# EAGLE schematic zx_kit3 (EAGLE 6.5.0)

## Sheet 1 of 2
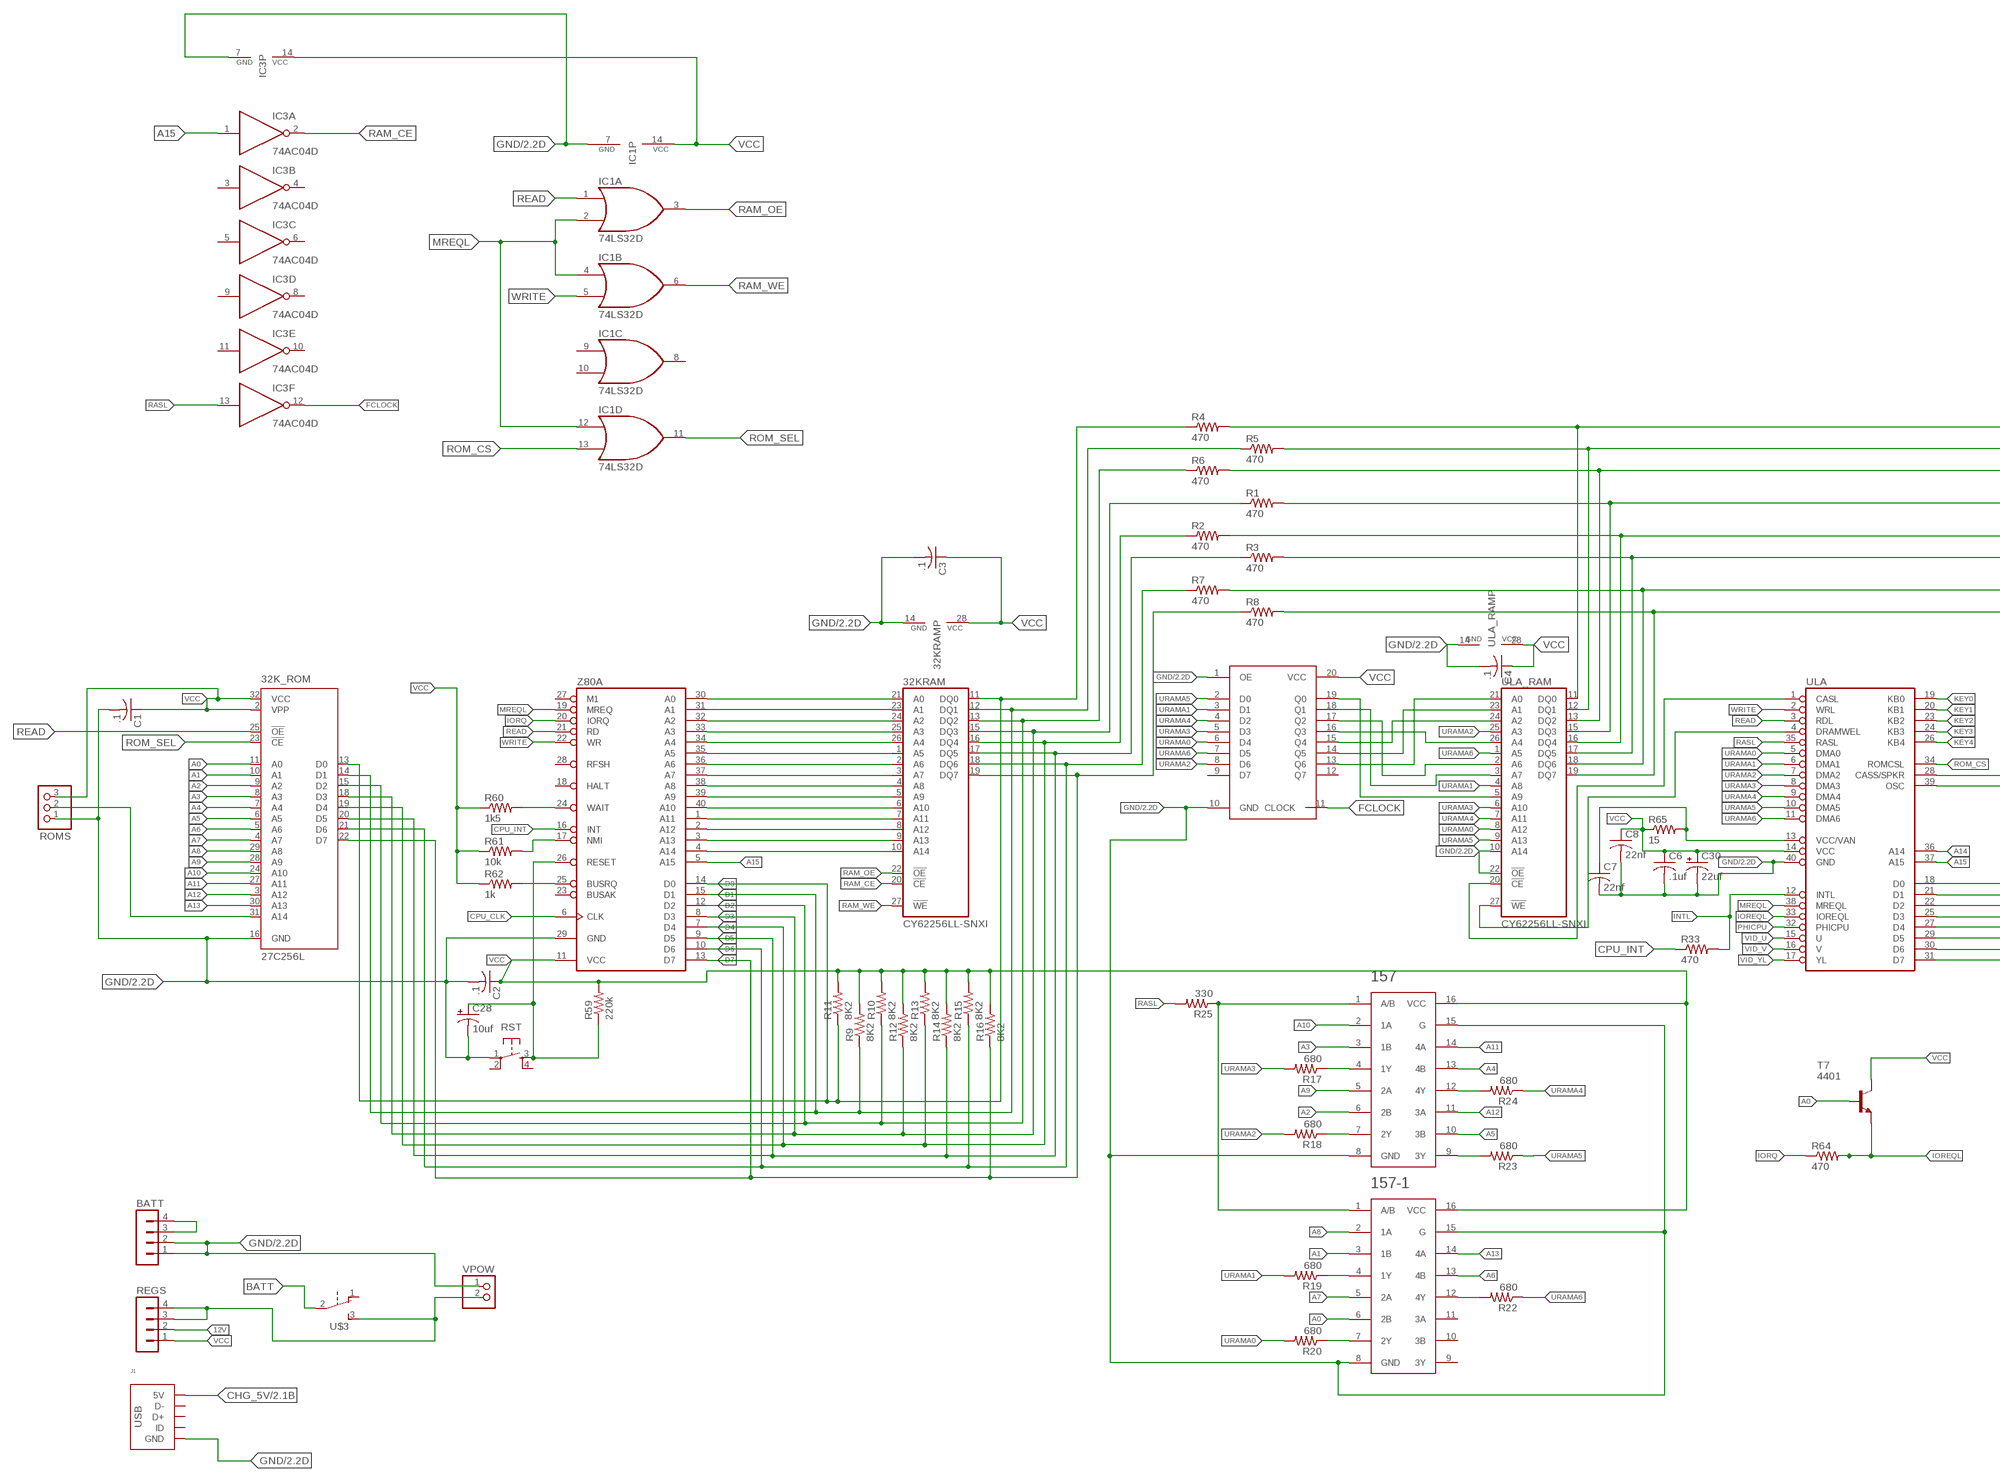
[diagram p0: schematic, sheet 1, part 1 of 3]
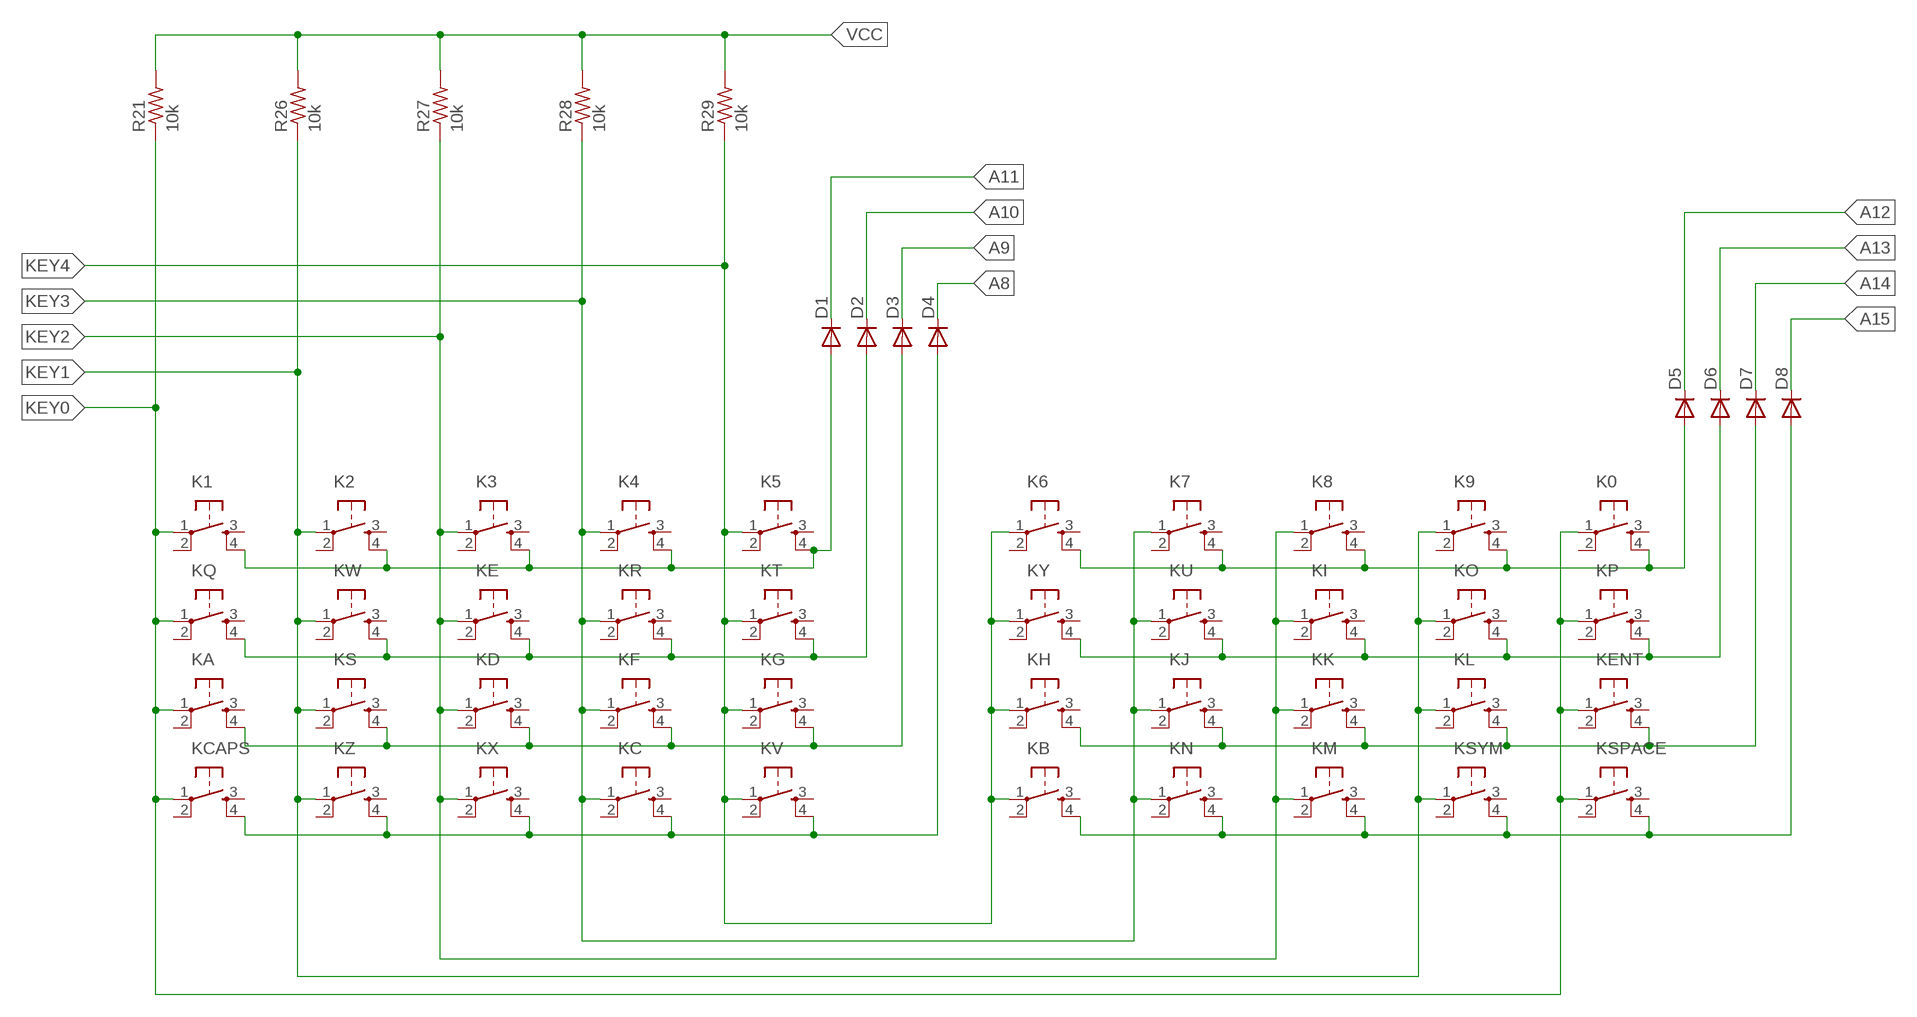
[diagram p1: schematic, sheet 1, part 2 of 3]
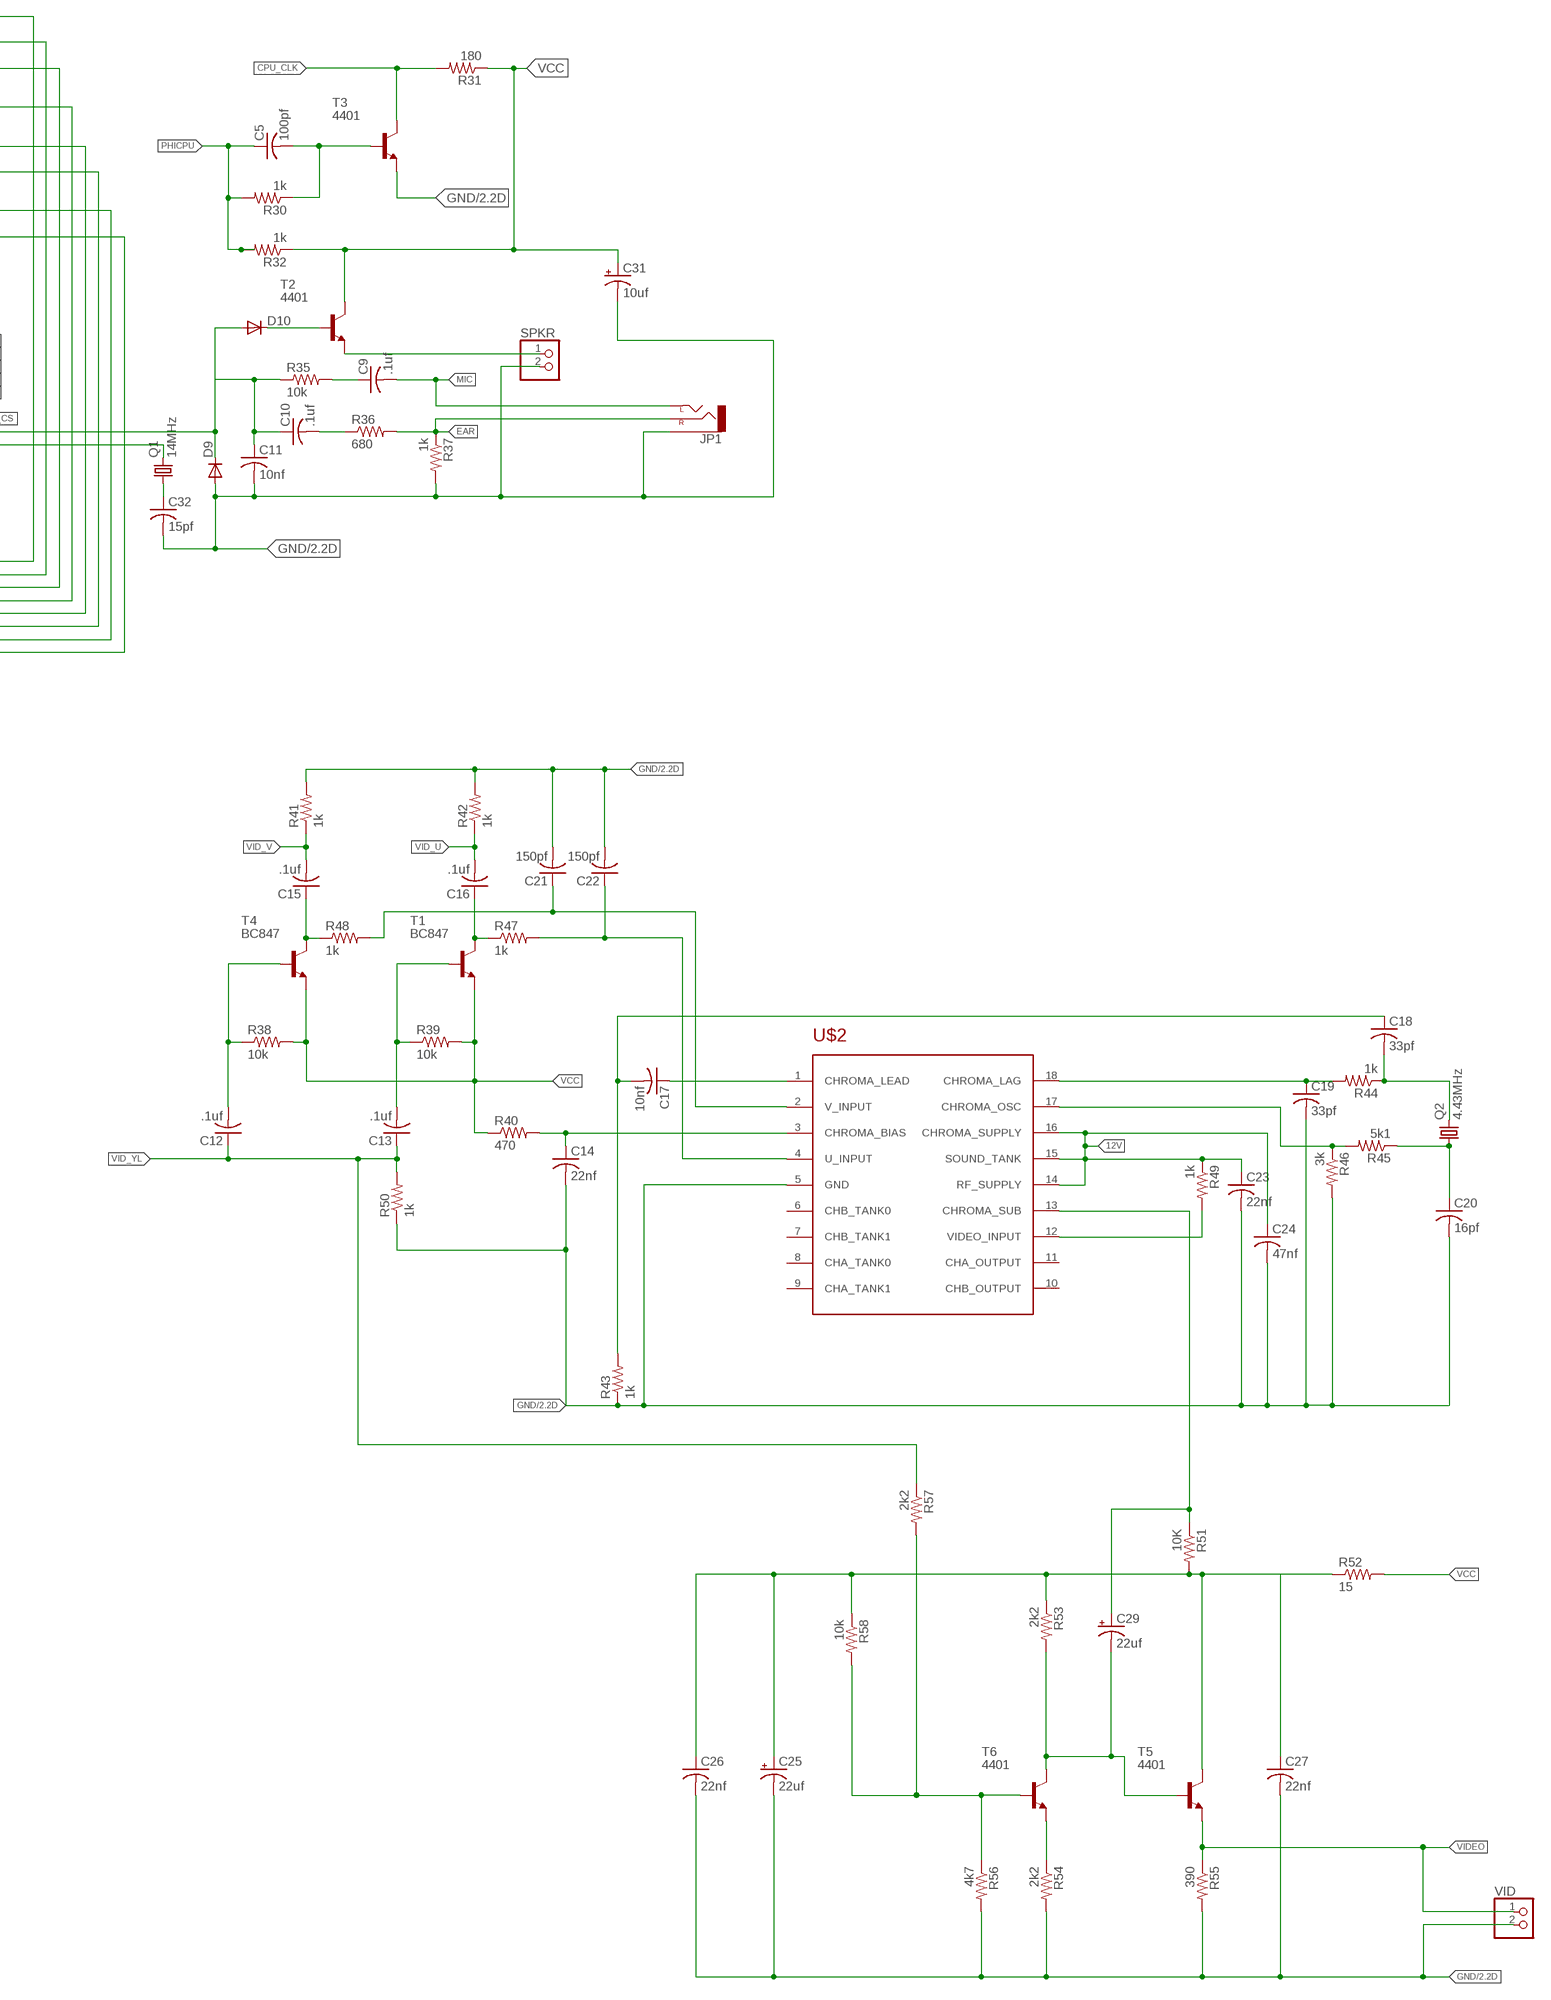
[diagram p2: schematic, sheet 1, part 3 of 3]

### Parts
32K_ROM  27C256L  [PLCC-32]
32KRAM  CY62256LL-SNXI  [SOJ28/3]
157  SN74HC157D  [SO16]
157-1  SN74HC157D  [SO16]
BATT  MA04-1  [MA04-1]
C1  .1  C-USC0805  [C0805]
C2  .1  C-USC0805  [C0805]
C3  .1  C-USC0805  [C0805]
C4  .1  C-USC0805  [C0805]
C5  100pf  C-USC0805  [C0805]
C6  .1uf  C-USC0805  [C0805]
C7  22nf  C-USC0805  [C0805]
C8  22nf  C-USC0805  [C0805]
C9  .1uf  C-USC0805  [C0805]
C10  .1uf  C-USC0805  [C0805]
C11  10nf  C-USC0805  [C0805]
C12  .1uf  C-USC0805  [C0805]
C13  .1uf  C-USC0805  [C0805]
C14  22nf  C-USC0805  [C0805]
C15  .1uf  C-USC0805  [C0805]
C16  .1uf  C-USC0805  [C0805]
C17  10nf  C-USC0805  [C0805]
C18  33pf  C-USC0805  [C0805]
C19  33pf  C-USC0805  [C0805]
C20  16pf  C-USC0805  [C0805]
C21  150pf  C-USC0805  [C0805]
C22  150pf  C-USC0805  [C0805]
C23  22nf  C-USC0805  [C0805]
C24  47nf  C-USC0805  [C0805]
C25  22uf  CPOL-USB  [PANASONIC_B]
C26  22nf  C-USC0805  [C0805]
C27  22nf  C-USC0805  [C0805]
C28  10uf  CPOL-USB  [PANASONIC_B]
C29  22uf  CPOL-USB  [PANASONIC_B]
C30  22uf  CPOL-USB  [PANASONIC_B]
C31  10uf  CPOL-USB  [PANASONIC_B]
C32  15pf  C-USC0805  [C0805]
D1  DIODE-SOD123  [SOD123]
D2  DIODE-SOD123  [SOD123]
D3  DIODE-SOD123  [SOD123]
D4  DIODE-SOD123  [SOD123]
D5  DIODE-SOD123  [SOD123]
D6  DIODE-SOD123  [SOD123]
D7  DIODE-SOD123  [SOD123]
D8  DIODE-SOD123  [SOD123]
D9  DIODE-SOD123  [SOD123]
D10  DIODE-SOD123  [SOD123]
IC1  74LS32D  [SO14]
IC3  74AC04D  [SO14]
J1  USBMC32599  [MC32599]
JP1  AUDIO-JACKPTH  [AUDIO-JACK]
K0  DTS-6  [DTS-6]
K1  DTS-6  [DTS-6]
K2  DTS-6  [DTS-6]
K3  DTS-6  [DTS-6]
K4  DTS-6  [DTS-6]
K5  DTS-6  [DTS-6]
K6  DTS-6  [DTS-6]
K7  DTS-6  [DTS-6]
K8  DTS-6  [DTS-6]
K9  DTS-6  [DTS-6]
KA  DTS-6  [DTS-6]
KB  DTS-6  [DTS-6]
KC  DTS-6  [DTS-6]
KCAPS  DTS-6  [DTS-6]
KD  DTS-6  [DTS-6]
KE  DTS-6  [DTS-6]
KENT  DTS-6  [DTS-6]
KF  DTS-6  [DTS-6]
KG  DTS-6  [DTS-6]
KH  DTS-6  [DTS-6]
KI  DTS-6  [DTS-6]
KJ  DTS-6  [DTS-6]
KK  DTS-6  [DTS-6]
KL  DTS-6  [DTS-6]
KM  DTS-6  [DTS-6]
KN  DTS-6  [DTS-6]
KO  DTS-6  [DTS-6]
KP  DTS-6  [DTS-6]
KQ  DTS-6  [DTS-6]
KR  DTS-6  [DTS-6]
KS  DTS-6  [DTS-6]
KSPACE  DTS-6  [DTS-6]
KSYM  DTS-6  [DTS-6]
KT  DTS-6  [DTS-6]
KU  DTS-6  [DTS-6]
KV  DTS-6  [DTS-6]
KW  DTS-6  [DTS-6]
KX  DTS-6  [DTS-6]
KY  DTS-6  [DTS-6]
KZ  DTS-6  [DTS-6]
Q1  14MHz  CRYSTALCTS406  [CTS406]
Q2  4.43MHz  CRYSTALHC49S  [HC49/S]
R1  470  R-US_M0805  [M0805]
R2  470  R-US_M0805  [M0805]
R3  470  R-US_M0805  [M0805]
R4  470  R-US_M0805  [M0805]
R5  470  R-US_M0805  [M0805]
R6  470  R-US_M0805  [M0805]
R7  470  R-US_M0805  [M0805]
R8  470  R-US_M0805  [M0805]
R9  8K2  R-US_M0805  [M0805]
R10  8K2  R-US_M0805  [M0805]
R11  8K2  R-US_M0805  [M0805]
R12  8K2  R-US_M0805  [M0805]
R13  8K2  R-US_M0805  [M0805]
R14  8K2  R-US_M0805  [M0805]
R15  8K2  R-US_M0805  [M0805]
R16  8K2  R-US_M0805  [M0805]
R17  680  R-US_M0805  [M0805]
R18  680  R-US_M0805  [M0805]
R19  680  R-US_M0805  [M0805]
R20  680  R-US_M0805  [M0805]
R21  10k  R-US_R0805  [R0805]
R22  680  R-US_M0805  [M0805]
R23  680  R-US_M0805  [M0805]
R24  680  R-US_M0805  [M0805]
R25  330  R-US_M0805  [M0805]
R26  10k  R-US_R0805  [R0805]
R27  10k  R-US_R0805  [R0805]
R28  10k  R-US_R0805  [R0805]
R29  10k  R-US_R0805  [R0805]
R30  1k  R-US_R0805  [R0805]
R31  180  R-US_R0805  [R0805]
R32  1k  R-US_R0805  [R0805]
R33  470  R-US_R0805  [R0805]
R35  10k  R-US_R0805  [R0805]
R36  680  R-US_R0805  [R0805]
R37  1k  R-US_R0805  [R0805]
R38  10k  R-US_R0805  [R0805]
R39  10k  R-US_R0805  [R0805]
R40  470  R-US_R0805  [R0805]
R41  1k  R-US_R0805  [R0805]
R42  1k  R-US_R0805  [R0805]
R43  1k  R-US_R0805  [R0805]
R44  1k  R-US_R0805  [R0805]
R45  5k1  R-US_R0805  [R0805]
R46  3k  R-US_R0805  [R0805]
R47  1k  R-US_R0805  [R0805]
R48  1k  R-US_R0805  [R0805]
R49  1k  R-US_R0805  [R0805]
R50  1k  R-US_R0805  [R0805]
R51  10K  R-US_R0805  [R0805]
R52  15  R-US_R0805  [R0805]
R53  2k2  R-US_R0805  [R0805]
R54  2k2  R-US_R0805  [R0805]
R55  390  R-US_R0805  [R0805]
R56  4k7  R-US_R0805  [R0805]
R57  2k2  R-US_R0805  [R0805]
R58  10k  R-US_R0805  [R0805]
R59  220k  R-US_M0805  [M0805]
R60  1k5  R-US_M0805  [M0805]
R61  10k  R-US_M0805  [M0805]
R62  1k  R-US_M0805  [M0805]
R64  470  R-US_R0805  [R0805]
R65  15  R-US_R1210  [R1210]
REGS  MA04-1  [MA04-1]
ROMS  PINHD-1X3  [1X03]
RST  DTS-6  [DTS-6]
SPKR  PINHD-1X2  [1X02]
T1  BC847  [SOT23]
T2  4401  MMBT4401LT1-NPN-SOT23-BEC  [SOT23-BEC]
T3  4401  MMBT4401LT1-NPN-SOT23-BEC  [SOT23-BEC]
T4  BC847  [SOT23]
T5  4401  MMBT4401LT1-NPN-SOT23-BEC  [SOT23-BEC]
T6  4401  MMBT4401LT1-NPN-SOT23-BEC  [SOT23-BEC]
T7  4401  MMBT4401LT1-NPN-SOT23-BEC  [SOT23-BEC]
U$1  MC74HC574A  [SO20W]
U$2  LM1889  [SOCKET-18]
U$3  MS12ASW30_01  [MS12ASG30_01]
ULA  ZXULA  [DIL40]
ULA_RAM  CY62256LL-SNXI  [SOJ28/3]
VID  PINHD-1X2  [1X02]
VPOW  PINHD-1X2  [1X02]
Z80A  Z80CPU  [DIL40]

### Nets
12V: C23.1 C24.1 R49.1 REGS.2 U$2.14(RF_SUPPLY) U$2.15(SOUND_TANK) U$2.16(CHROMA_SUPPLY)
A0: 32K_ROM.11(A0) 32KRAM.21(A0) 157-1.6(2B) T7.B Z80A.30(A0)
A1: 32K_ROM.10(A1) 32KRAM.23(A1) 157-1.3(1B) Z80A.31(A1)
A2: 32K_ROM.9(A2) 32KRAM.24(A2) 157.6(2B) Z80A.32(A2)
A3: 32K_ROM.8(A3) 32KRAM.25(A3) 157.3(1B) Z80A.33(A3)
A4: 32K_ROM.7(A4) 32KRAM.26(A4) 157.13(4B) Z80A.34(A4)
A5: 32K_ROM.6(A5) 32KRAM.1(A5) 157.10(3B) Z80A.35(A5)
A6: 32K_ROM.5(A6) 32KRAM.2(A6) 157-1.13(4B) Z80A.36(A6)
A7: 32K_ROM.4(A7) 32KRAM.3(A7) 157-1.5(2A) Z80A.37(A7)
A8: 32K_ROM.29(A8) 32KRAM.4(A8) 157-1.2(1A) D4.C Z80A.38(A8)
A9: 32K_ROM.28(A9) 32KRAM.5(A9) 157.5(2A) D3.C Z80A.39(A9)
A10: 32K_ROM.24(A10) 32KRAM.6(A10) 157.2(1A) D2.C Z80A.40(A10)
A11: 32K_ROM.27(A11) 32KRAM.7(A11) 157.14(4A) D1.C Z80A.1(A11)
A12: 32K_ROM.3(A12) 32KRAM.8(A12) 157.11(3A) D5.C Z80A.2(A12)
A13: 32K_ROM.30(A13) 32KRAM.9(A13) 157-1.14(4A) D6.C Z80A.3(A13)
A14: 32KRAM.10(A14) D7.C ULA.36(A14) Z80A.4(A14)
A15: D8.C IC3.1(A:I) ULA.37(A15) Z80A.5(A15)
BATT: U$3.2(P) ; also sheet 2
CASL: ULA.1(CASL) ULA_RAM.20(!CE)
CASS: C10.1 C11.1 D9.C D10.A R35.1 ULA.28(CASS/SPKR)
CHG_5V: J1.V_BUS(5V) ; also sheet 2
CPU_CLK: R31.2 T3.C Z80A.6(CLK)
CPU_INT: R33.1 Z80A.16(INT)
CPU_RESET: C28.+ R59.1 RST.3 Z80A.26(RESET)
D0: 32K_ROM.13(D0) 32KRAM.11(DQ0) R4.1 R11.1 Z80A.14(D0)
D1: 32K_ROM.14(D1) 32KRAM.12(DQ1) R5.1 R9.1 Z80A.15(D1)
D2: 32K_ROM.15(D2) 32KRAM.13(DQ2) R6.1 R10.1 Z80A.12(D2)
D3: 32K_ROM.18(D3) 32KRAM.15(DQ3) R1.1 R12.1 Z80A.8(D3)
D4: 32K_ROM.19(D4) 32KRAM.16(DQ4) R2.1 R13.1 Z80A.7(D4)
D5: 32K_ROM.20(D5) 32KRAM.17(DQ5) R3.1 R14.1 Z80A.9(D5)
D6: 32K_ROM.21(D6) 32KRAM.18(DQ6) R7.1 R15.1 Z80A.10(D6)
D7: 32K_ROM.22(D7) 32KRAM.19(DQ7) R8.1 R16.1 Z80A.13(D7)
DRAWMWEL: ULA.4(DRAMWEL) ULA_RAM.27(!WE)
EAR: JP1.RING(RIGHT) R36.2 R37.1
FCLOCK: IC3.12(F:O) U$1.11(CLOCK)
FLIPCLOCK: U$1.19(Q0) ULA_RAM.5(A9)
GND: 32K_ROM.16(GND) 32KRAM.14(GND) 157-1.8(GND) 157-1.15(G) 157.8(GND) 157.15(G) BATT.1 BATT.2 C1.2 C2.2 C3.2 C4.2 C6.2 C7.2 C8.2 C11.2 C14.2 C19.2 C20.2 C21.2 C22.2 C23.2 C24.2 C25.- C26.2 C27.2 C28.- C30.- C31.- C32.2 D9.A IC1.7(P:GND) IC3.7(P:GND) J1.GND J1.SH_0(GND) J1.SH_1(GND) J1.SH_2(GND) J1.SH_3(GND) JP1.SLEEVE R37.2 R41.2 R42.2 R43.1 R46.2 R50.1 R54.2 R55.2 R56.2 ROMS.1 RST.1 SPKR.2 T3.E U$1.1(OE) U$1.10(GND) U$2.5(GND) ULA.40(GND) ULA_RAM.10(A14) ULA_RAM.14(GND) ULA_RAM.22(!OE) VID.2 VPOW.1 Z80A.29(GND) ; also sheet 2
INTL: R33.2 ULA.12(INTL)
IOREQL: R64.2 T7.E ULA.33(IOREQL)
IORQ: R64.1 Z80A.20(IORQ)
KEY0: K0.1 K1.1 KA.1 KCAPS.1 KENT.1 KP.1 KQ.1 KSPACE.1 R21.1 ULA.19(KB0)
KEY1: K2.1 K9.1 KL.1 KO.1 KS.1 KSYM.1 KW.1 KZ.1 R26.1 ULA.20(KB1)
KEY2: K3.1 K8.1 KD.1 KE.1 KI.1 KK.1 KM.1 KX.1 R27.1 ULA.23(KB2)
KEY3: K4.1 K7.1 KC.1 KF.1 KJ.1 KN.1 KR.1 KU.1 R28.1 ULA.24(KB3)
KEY4: K5.1 K6.1 KB.1 KG.1 KH.1 KT.1 KV.1 KY.1 R29.1 ULA.26(KB4)
MIC: C9.2 JP1.TIP(LEFT)
MREQL: IC1.2(A:I1) IC1.4(B:I0) IC1.12(D:I0) ULA.38(MREQL) Z80A.19(MREQ)
N$2: R4.2 ULA.18(D0) ULA_RAM.11(DQ0)
N$3: R5.2 ULA.21(D1) ULA_RAM.12(DQ1)
N$4: R6.2 ULA.22(D2) ULA_RAM.13(DQ2)
N$5: R1.2 ULA.25(D3) ULA_RAM.15(DQ3)
N$6: R2.2 ULA.27(D4) ULA_RAM.16(DQ4)
N$7: R3.2 ULA.29(D5) ULA_RAM.17(DQ5)
N$8: R7.2 ULA.30(D6) ULA_RAM.18(DQ6)
N$9: R8.2 ULA.31(D7) ULA_RAM.19(DQ7)
N$10: U$1.13(Q6) ULA_RAM.21(A0)
N$11: U$1.14(Q5) ULA_RAM.23(A1)
N$12: U$1.15(Q4) ULA_RAM.24(A2)
N$13: U$1.16(Q3) ULA_RAM.26(A4)
N$14: U$1.17(Q2) ULA_RAM.2(A6)
N$15: 157.4(1Y) R17.1
N$16: Q1.3 ULA.39(OSC)
N$17: 157.7(2Y) R18.1
N$18: U$1.18(Q1) ULA_RAM.3(A7)
N$19: 157-1.4(1Y) R19.1
N$20: 157-1.7(2Y) R20.1
N$21: C5.2 R30.1 T3.B
N$22: C12.2 R38.1 T4.1(B)
N$23: D10.C T2.B
N$24: C9.1 R35.2
N$25: 157-1.12(4Y) R22.2
N$26: D1.A K1.4 K2.4 K3.4 K4.4 K5.4
N$27: D2.A KE.4 KQ.4 KR.4 KT.4 KW.4
N$28: R60.2 Z80A.24(WAIT)
N$29: D3.A KA.4 KD.4 KF.4 KG.4 KS.4
N$30: D4.A KC.4 KCAPS.4 KV.4 KX.4 KZ.4
N$31: 157-1.1(A/B) 157.1(A/B) R25.1
N$32: D8.A KB.4 KM.4 KN.4 KSPACE.4 KSYM.4
N$33: D7.A KENT.4 KH.4 KJ.4 KK.4 KL.4
N$34: 157.9(3Y) R23.2
N$35: D6.A KI.4 KO.4 KP.4 KU.4 KY.4
N$36: D5.A K0.4 K6.4 K7.4 K8.4 K9.4
N$37: 157.12(4Y) R24.2
N$38: C13.2 R39.1 T1.1(B)
N$39: C10.2 R36.1
N$40: C14.1 R40.2 U$2.3(CHROMA_BIAS)
N$41: C15.1 R48.1 T4.3(C)
N$42: 32K_ROM.31(A14) ROMS.2
N$43: C16.1 R47.1 T1.3(C)
N$44: R49.2 U$2.12(VIDEO_INPUT)
N$45: C17.1 U$2.1(CHROMA_LEAD)
N$46: C17.2 C18.1 R43.2
N$47: C19.1 R44.2 U$2.18(CHROMA_LAG)
N$48: C18.2 Q2.2 R44.1
N$49: R45.2 R46.1 U$2.17(CHROMA_OSC)
N$50: C22.1 R47.2 U$2.4(U_INPUT)
N$51: C20.1 Q2.1 R45.1
N$52: C21.1 R48.2 U$2.2(V_INPUT)
N$53: C29.+ R51.1 U$2.13(CHROMA_SUB)
N$54: R61.2 Z80A.17(NMI)
N$55: C25.+ C26.1 C27.1 R51.2 R52.1 R53.1 R58.1 T5.C
N$56: C29.- R53.2 T5.B T6.C
N$57: R54.1 T6.E
N$58: R62.2 Z80A.25(BUSRQ)
N$59: R56.1 R57.2 R58.2 T6.B
N$60: C32.1 Q1.1
N$62: REGS.3 REGS.4 U$3.3(S) VPOW.2
N$71: BATT.3 BATT.4
PHICPU: C5.1 R30.2 R32.2 ULA.32(PHICPU)
RAM_CE: 32KRAM.20(!CE) IC3.2(A:O)
RAM_OE: 32KRAM.22(!OE) IC1.3(A:O)
RAM_WE: 32KRAM.27(!WE) IC1.6(B:O)
RASL: IC3.13(F:I) R25.2 ULA.35(RASL)
READ: 32K_ROM.25(!OE) IC1.1(A:I0) ULA.3(RDL) Z80A.21(RD)
ROM_CS: IC1.13(D:I1) ULA.34(ROMCSL)
ROM_SEL: 32K_ROM.23(!CE) IC1.11(D:O)
SPEAKER: SPKR.1 T2.E
URAMA0: R20.2 U$1.6(D4) ULA.5(DMA0) ULA_RAM.8(A12)
URAMA1: R19.2 U$1.3(D1) ULA.6(DMA1) ULA_RAM.4(A8)
URAMA2: R18.2 U$1.8(D6) ULA.7(DMA2) ULA_RAM.25(A3)
URAMA3: R17.2 U$1.5(D3) ULA.8(DMA3) ULA_RAM.6(A10)
URAMA4: R24.1 U$1.4(D2) ULA.9(DMA4) ULA_RAM.7(A11)
URAMA5: R23.1 U$1.2(D0) ULA.10(DMA5) ULA_RAM.9(A13)
URAMA6: R22.1 U$1.7(D5) ULA.11(DMA6) ULA_RAM.1(A5)
VCC: 32K_ROM.2(VPP) 32K_ROM.32(VCC) 32KRAM.28(VCC) 157-1.16(VCC) 157.16(VCC) C1.1 C2.1 C3.1 C4.1 C6.1 C8.1 C30.+ C31.+ IC1.14(P:VCC) IC3.14(P:VCC) R9.2 R10.2 R11.2 R12.2 R13.2 R14.2 R15.2 R16.2 R21.2 R26.2 R27.2 R28.2 R29.2 R31.1 R32.1 R38.2 R39.2 R40.1 R52.2 R59.2 R60.1 R61.1 R62.1 R65.1 REGS.1 ROMS.3 T1.2(E) T2.C T4.2(E) T7.C U$1.20(VCC) ULA.14(VCC) ULA_RAM.28(VCC) Z80A.11(VCC)
VCC/VAN: C7.1 R65.2 ULA.13(VCC/VAN)
VID_U: C16.2 R42.1 ULA.15(U)
VID_V: C15.2 R41.1 ULA.16(V)
VID_YL: C12.1 C13.1 R50.2 R57.1 ULA.17(YL)
VIDEO: R55.1 T5.E VID.1
WRITE: IC1.5(B:I1) ULA.2(WRL) Z80A.22(WR)
Unconnected: 157-1.9(3Y) 157-1.10(3B) 157-1.11(3A) IC1.8(C:O) IC1.9(C:I0) IC1.10(C:I1) IC3.3(B:I) IC3.4(B:O) IC3.5(C:I) IC3.6(C:O) IC3.8(D:O) IC3.9(D:I) IC3.10(E:O) IC3.11(E:I) J1.D+ J1.D- J1.N/C(ID) K0.2 K0.3 K1.2 K1.3 K2.2 K2.3 K3.2 K3.3 K4.2 K4.3 K5.2 K5.3 K6.2 K6.3 K7.2 K7.3 K8.2 K8.3 K9.2 K9.3 KA.2 KA.3 KB.2 KB.3 KC.2 KC.3 KCAPS.2 KCAPS.3 KD.2 KD.3 KE.2 KE.3 KENT.2 KENT.3 KF.2 KF.3 KG.2 KG.3 KH.2 KH.3 KI.2 KI.3 KJ.2 KJ.3 KK.2 KK.3 KL.2 KL.3 KM.2 KM.3 KN.2 KN.3 KO.2 KO.3 KP.2 KP.3 KQ.2 KQ.3 KR.2 KR.3 KS.2 KS.3 KSPACE.2 KSPACE.3 KSYM.2 KSYM.3 KT.2 KT.3 KU.2 KU.3 KV.2 KV.3 KW.2 KW.3 KX.2 KX.3 KY.2 KY.3 KZ.2 KZ.3 RST.2 RST.4 U$1.9(D7) U$1.12(Q7) U$2.6(CHB_TANK0) U$2.7(CHB_TANK1) U$2.8(CHA_TANK0) U$2.9(CHA_TANK1) U$2.10(CHB_OUTPUT) U$2.11(CHA_OUTPUT) U$3.1(O) Z80A.18(HALT) Z80A.23(BUSAK) Z80A.27(M1) Z80A.28(RFSH)

## Sheet 2 of 2
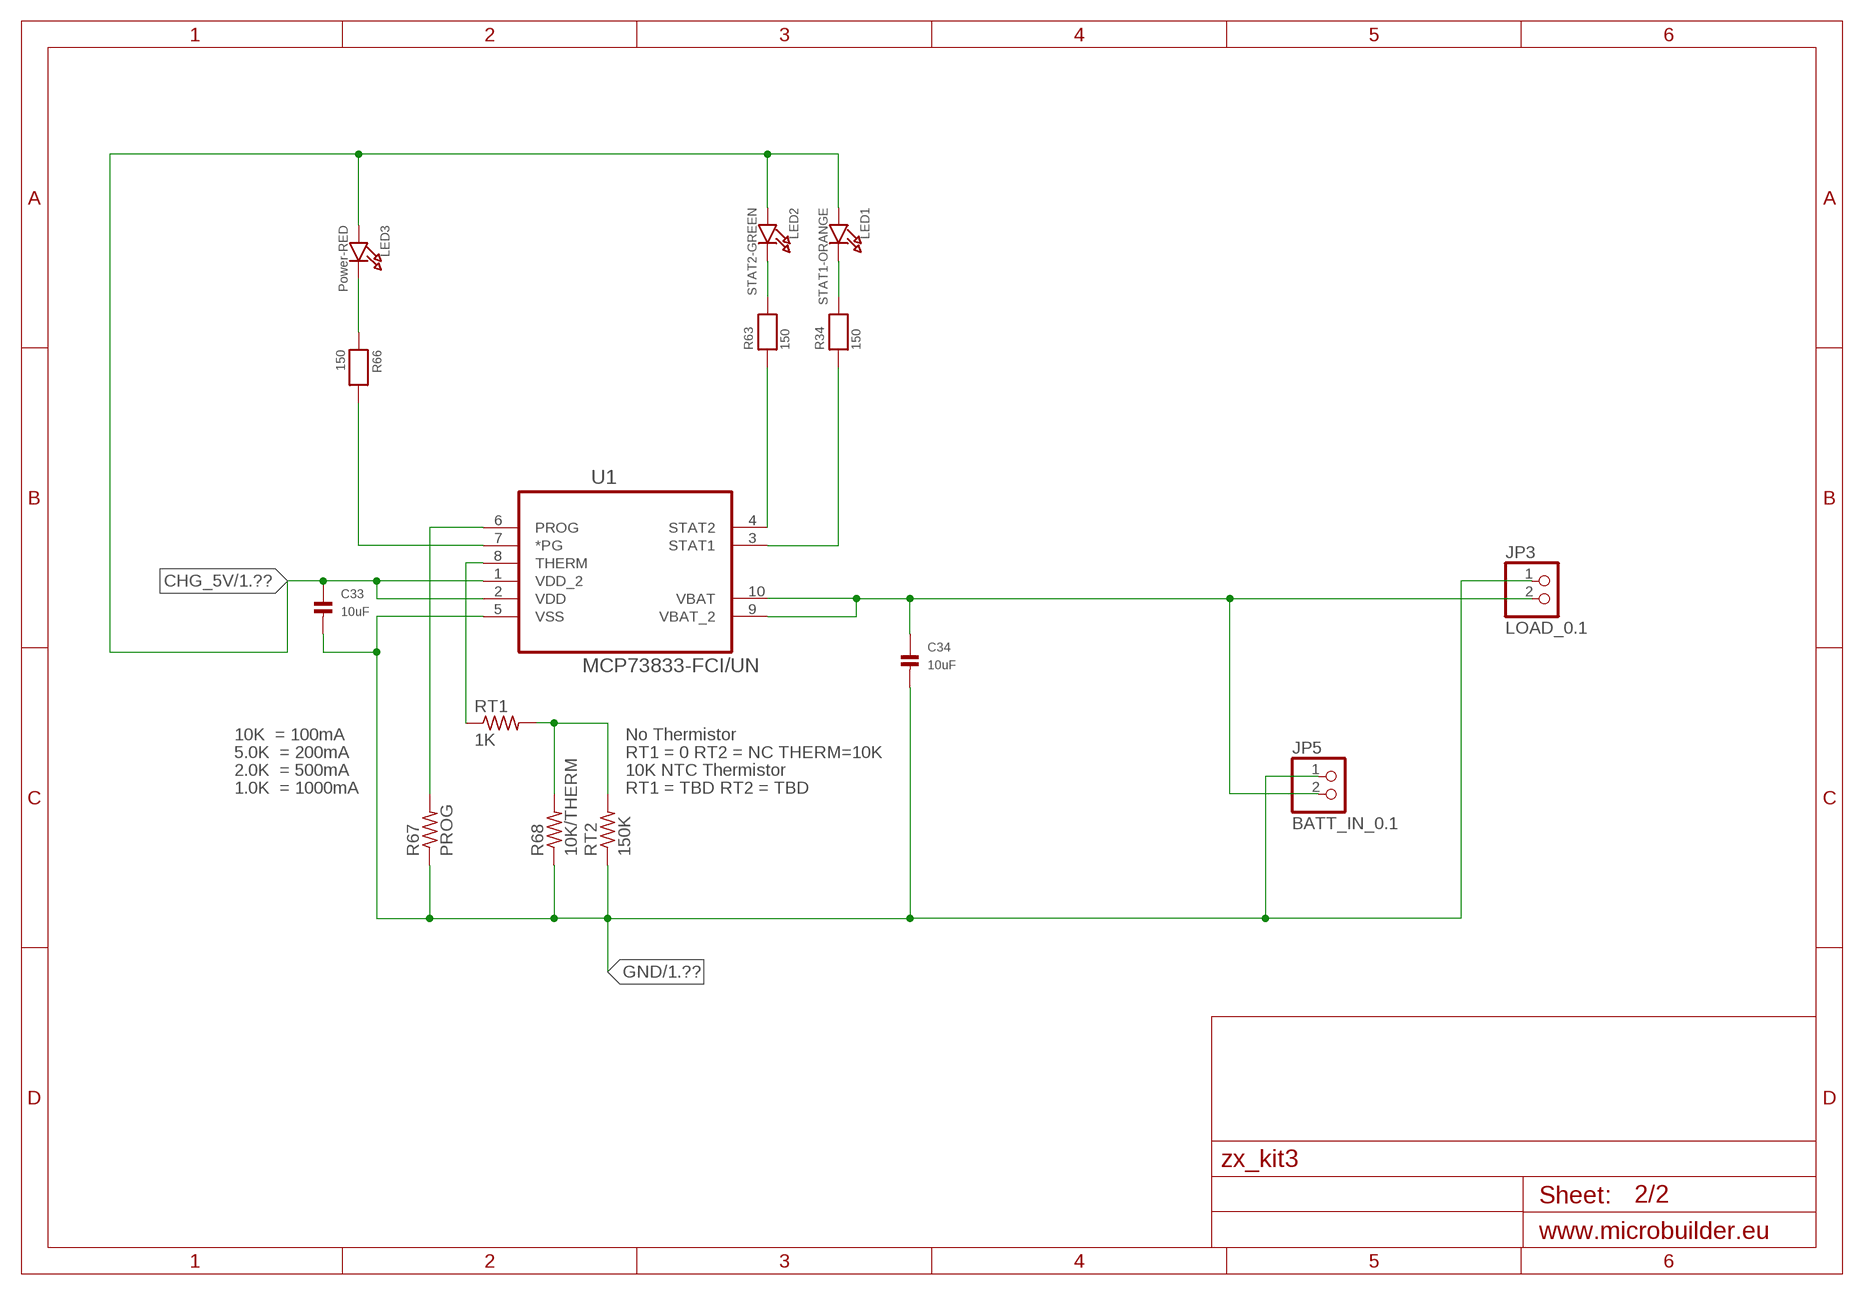
[diagram p3: schematic, sheet 2]

### Parts
C33  10uF  CAP_CERAMIC0805  [0805]
C34  10uF  CAP_CERAMIC0805  [0805]
JP3  LOAD_0.1  HEADER-1X2  [1X02_OVAL]
JP5  BATT_IN_0.1  HEADER-1X2  [1X02_OVAL]
LED1  STAT1-ORANGE  LED0805  [CHIPLED_0805]
LED2  STAT2-GREEN  LED0805  [CHIPLED_0805]
LED3  Power-RED  LED0805  [CHIPLED_0805]
R34  150  RESISTOR0805  [0805]
R63  150  RESISTOR0805  [0805]
R66  150  RESISTOR0805  [0805]
R67  PROG  RESISTOR_DUAL  [0805-THM]
R68  10K/THERM  R-US_FLIPFLOP  [0805-THM]
RT1  1K  R-US_R0805  [R0805]
RT2  150K  R-US_R0805  [R0805]
U1  MCP73833-FCI/UN  [SOP50P490X110-10N]

### Nets
BATT: C34.1 JP3.2 JP5.2 U1.9(VBAT_2) U1.10(VBAT) ; also sheet 1
CHG_5V: C33.1 LED1.A LED2.A LED3.A U1.1(VDD_2) U1.2(VDD) ; also sheet 1
GND: C33.2 C34.2 JP3.1 JP5.1 R67.1 R68.1 RT2.1 U1.5(VSS) ; also sheet 1
N$1: R34.1 U1.3(STAT1)
N$61: LED1.C R34.2
N$63: LED2.C R63.2
N$64: R63.1 U1.4(STAT2)
N$65: R66.2 U1.7(*PG)
N$66: LED3.C R66.1
N$68: RT1.1 U1.8(THERM)
N$69: R67.2 U1.6(PROG)
N$70: R68.2 RT1.2 RT2.2

### Notes on the sheet
- 10K  = 100mA | No Thermistor
- 5.0K  = 200mA | RT1 = 0 RT2 = NC THERM=10K
- 2.0K  = 500mA | 10K NTC Thermistor
- 1.0K  = 1000mA | RT1 = TBD RT2 = TBD

## Library data of the parts
32K_ROM = microchip:27*256: CMOS EPROM 256 K (32 K x 8), low voltage; MPN: AT27C256R-70JU; OC_FARNELL: 1095779; OC_NEWARK: 96K6554
32KRAM ULA_RAM = zx_SRAM:CY62256LL-?*: 256K (32K x 8) CMOS-Static RAM Source: http://download.cypress.com.edgesuite.net/design_resources/datasheets/contents/cy62256_8.pdf
157 157-1 = zx_ULA:SN74HC157D: Multiplexer used to select address lines of video RAM
BATT REGS = con-lstb:MA04-1: PIN HEADER; OC_FARNELL: unknown; OC_NEWARK: unknown
C1-C4 = resistor:C-US: CAPACITOR, American symbol
C5-C24 C26 C27 C32 = rcl:C-US: CAPACITOR, American symbol
C25 C28-C31 = rcl:CPOL-US: POLARIZED CAPACITOR, American symbol
C33 C34 = microbuilder:CAP_CERAMIC: Ceramic Capacitors 0402 - 0402 Surface Mount Capacitors 16pF 50V 5% [Digikey: 445-4899-2-ND] 18pF 50V 5% [Digikey: 490-1281-2-ND] 22pF 50V 5% [Digikey: 490-1283-2-ND] 68pF 50V 5% [Digikey: 490-1289-2-ND] 0.1uF 10V 10% [Digikey: 490-1318-2-ND] 1.0uF 6.3V 10% [Digikey: 490-1320-2-ND] 0603 - 0603 Surface Mount Capacitors 16 pF 50V 5% [Digikey: 445-5051-2-ND] 22 pF 50V [Digikey: PCC220ACVTR-ND] 33 pF 50V 5% [Digikey: 490-1415-1-ND] 56pF 50V 5% [Digikey: 490-1421-1-ND] 220pF 50V 5% [Digikey: 445-1285-1-ND] 680 pF 50V 2200 pF 50V 5% C0G [Digikey: 445-1297-1-ND] 5600 pF 100V 5% X7R [Digikey: 478-3711-1-ND] 0.1 µF 25V 10% [Digikey: PCC2277TR-ND] 0.22 µF 16V 10% X7R [Digikey: 445-1318-1-ND] 1.0 µF 25V 10% [Digikey: 445-5146-2-ND] 0603 - RF Specific 3pF 250V +/-0.1pF RF [Digikey: 712-1347-1-ND] 18 pF 250V 5% [Digikey: 478-3505-1-ND or 712-1322-1-ND] 56 pF 250V 5% C0G RF [Digikey: 490-4867-1-ND] 68 pF 250V RF [Digikey: 490-4868-1-ND] 0805 - 0805 Surface Mount Capacitors 220 pF 250V 2% RF Ceramic Capacitor [Digikey: 712-1398-1-ND] 1000 pF 50V 2% NP0 Ceramic Capacitor [Digikey: 478-3760-1-ND] 0.1 µF 25V 10% Ceramic Capacitor [Digikey: PCC1828TR-ND] 1.0 µF 16V 10% Ceramic Capacitor[Digikey: 490-1691-2-ND] 10.0 µF 10V 10% Ceramic Capacitor[Digikey: 709-1228-1-ND] 10.0 uF 16V 10% Ceramic Capacitor [Digikey: 478-5165-2-ND] 47 uF 6.3V 20% Ceramic Capacitor [Digikey: 399-5506-1-ND] 1206 - 1206 Surface Mount Capacitors 47uF 10V 20% Ceramic Capacitor [Digikey: 399-5508-1-ND]
D1-D10 = diode:DIODE-: DIODE
IC1 = 74xx-us:74*32: Quad 2-input OR gate
IC3 = 74xx-eu:74*04: Hex INVERTER
J1 = XB1_Monitor:USB
JP1 = SparkFun-Connectors:AUDIO-JACK: 3.5mm Audio Jack Simple 3.5mm common PCB mount audio jack. SKU: PRT-08032
JP3 JP5 = microbuilder:HEADER-1X2: PIN HEADER
K0 K1-K9 KA KB KC KCAPS KD KE KENT KF KG KH KI KJ KK KL KM KN KO KP KQ KR KS KSPACE KSYM KT KU KV KW KX KY KZ RST = switch-tact:DTS-6
LED1-LED3 = microbuilder:LED: LED 0603 - 0603 Surface Mount Package 2mA: Green LED - Low Power (3.9mcd, 2ma, 1.7Vf) - Digikey: 475-2709-2-ND Orange LED - Low Power (9.8mcd, 2ma, 1.8Vf) - Digikey: 475-1194-2-ND Red LED - Low Power (5mcd, 2ma, 1.8Vf) - Digikey: 475-1195-2-ND Yellow LED - Low Power (7mcd, 2ma, 1.8Vf) - Digikey: 475-1196-2-ND 5mA: Blue LED - Low Power (17mcd, 5ma, 2.9Vf) - Digikey: LNJ937W8CRACT-ND 0805 - 0805 Surface Mount Package 2mA: Red LED (8.8mcd, 2mA, 1.8Vf, Clear) - Low Power [Digikey: 475-2510-1-ND] Green LED (5mcd, 2mA, 1.8Vf, Clear) - Low Power [Digikey: 475-2730-1-ND] Yellow LED (11.3mcd, 2mA, 1.8Vf, Clear) - Low Power [Digikey: 475-2555-1-ND] 20mA: Red LED (104mcd, 20mA, Diffused) - LS R976 [Digikey: 475-1278-6-ND] Red LED (12mcd, 20mA, 2.0Vf, Clear) - APT2012EC [Digikey: 754-1128-1-ND] Green LED (15mcd, 20mA, 2.2Vf, Clear) - APT2012GC [Digikey: 754-1131-1-ND] Orange LED (160mcd, 20mA, 2.1Vf, Clear) - APT2012SECK [Digikey: 754-1130-1-ND] 1206 - 1206 Surface Mount Package Green LED (26mcd, 20mA, Diffused) - LG N971 [Digikey: 475-1407-6-ND] Red LED (15mcd, 20mA, Diffused) - LH N974 [Digikey: 475-1416-6-ND]
Q1 = XB1_Monitor:CRYSTAL: CRYSTAL; OC_FARNELL: unknown; OC_NEWARK: unknown
Q2 = XB1_Monitor:CRYSTAL: CRYSTAL; OC_FARNELL: 1667008; OC_NEWARK: unknown
R1-R33 R35-R62 R64 R65 = resistor:R-US_: RESISTOR, American symbol
R34 R63 R66 = microbuilder:RESISTOR: Resistors 0402 - 0402 Surface Mount Package 22 Ohm 1% 1/16W [Digikey: 311-22.0LRTR-ND] 33 Ohm 5% 1/16W 1.0K 5% 1/16W 1.5K 5% 1/16W 2.0K 1% 1/16W 10.0K 1% 1/16W [Digikey: 311-10.0KLRTR-ND] 10.0K 5% 1/16W [Digikey: RMCF0402JT10K0TR-ND] 12.1K 1% 1/16W [Digikey: 311-22.0LRTR-ND] 100.0K 5% 1/16W 0603 - 0603 Surface Mount Package 0 Ohm 1/10 Watt 1% Resistor 15 Ohm 1/10 Watt 1% Resistor 33 Ohm 1/10 Watt 1% Resistor 49.9 Ohm 1/10 Watt 1% Resistor 100 Ohm 1/10 Watt 1% Resistor 150 Ohm 1/10 Watt 1% Resistor 240 Ohm 1/10 Watt 1% Resistor 390 Ohm 1/10 Watt 1% Resistor 560 Ohm 1/10 Watt 1% Resistor 680 Ohm 1/10 Watt 1% Resistor 750 Ohm 1/10 Watt 1% Resistor 1.0K Ohm 1/10 Watt 1% Resistor 1.5K Ohm 1/10 Watt 1% Resistor 2.0K Ohm 1/10 Watt 1% Resistor 2.2K Ohm 1/10 Watt 1% Resistor 3.3K Ohm 1/10 Watt 1% Resistor 4.7K Ohm 1/10 Watt 1% Resistor 10.0K Ohm 1/10 Watt 1% Resistor 12.0K Ohm 1/10 Watt 1% Resistor 12.1K Ohm 1/10 Watt 1% Resistor 20.0K Ohm 1/10 Watt 1% Resistor 33.0K Ohm 1/10 Watt 1% Resistor 100.0K Ohm 1/10 Watt 1% Resistor 0805 - 0805 Surface Mount Package 0 Ohm 1/8 Watt 1% Resistor 33 Ohm 1/8 Watt 1% Resistor 100 Ohm 1/8 Watt 1% Resistor 150 Ohm 1/8 Watt 1% Resistor 200 Ohm 1/8 Watt 1% Resistor 240 Ohm 1/8 Watt 1% Resistor 330 Ohm 1/8 Watt 1% Resistor 390 Ohm 1/8 Watt 1% Resistor 470 Ohm 1/8 Watt 1% Resistor 1.0K Ohm 1/8 Watt 1% Resistor 1.5K Ohm 1/8 Watt 1% Resistor 2.0K Ohm 1/8 Watt 1% Resistor 4.7K Ohm 1/8 Watt 1% Resistor 5.1K Ohm 1/8 Watt 1% Resistor 5.6K Ohm 1/8 Watt 1% Resistor 10.0K Ohm 1/8 Watt 1% Resistor 22.0K Ohm 1/8 Watt 1% Resistor 33.0K Ohm 1/8 Watt 1% Resistor 100K Ohm 1/8 Watt 1% Resistor 1206 - 1206 Surface Mount Package
R67 = microbuilder:RESISTOR_DUAL: Flip Flop resistor An 0805 resistor inside a standard 1/4W 5% resistor. Makes for easy mods Footprint taken from the Adafruit Industries Eagle Library.
R68 RT1 RT2 = adafruit:R-US_: RESISTOR, American symbol
ROMS = pinhead:PINHD-1X3: PIN HEADER
SPKR VID VPOW = pinhead:PINHD-1X2: PIN HEADER
T1 T4 = transistor-neu-to92:BC847: NPN TRANSISTOR
T2 T3 T5-T7 = transistor:*-NPN-: NPN Transistror BF959 corrected 2008.03.06
U1 = MCP73833:MCP73833-FCI/UN: LI-ION/LI-POLY CONTROLLERS; MPN: MCP73833-FCI/UN; OC_FARNELL: 1605576; OC_NEWARK: 88K5666; PACKAGE: MSOP10; SUPPLIER: Microchip
U$1 = zx_ULA:MC74HC574A: Octal 3-State Noninverting D Flip Flop
U$2 = zx_ULA:LM1889: LM1889 TV Video Modulator
U$3 = MS12ASW30:MS12ASW30_01
ULA = zx_ULA:ZXULA: ZX Spectrum Custom ULA
Z80A = zilog:Z80CPU: Z80 FAMILY DEVICE